# EAGLE schematic washberry (EAGLE 6.4)

## Sheet 1 of 3
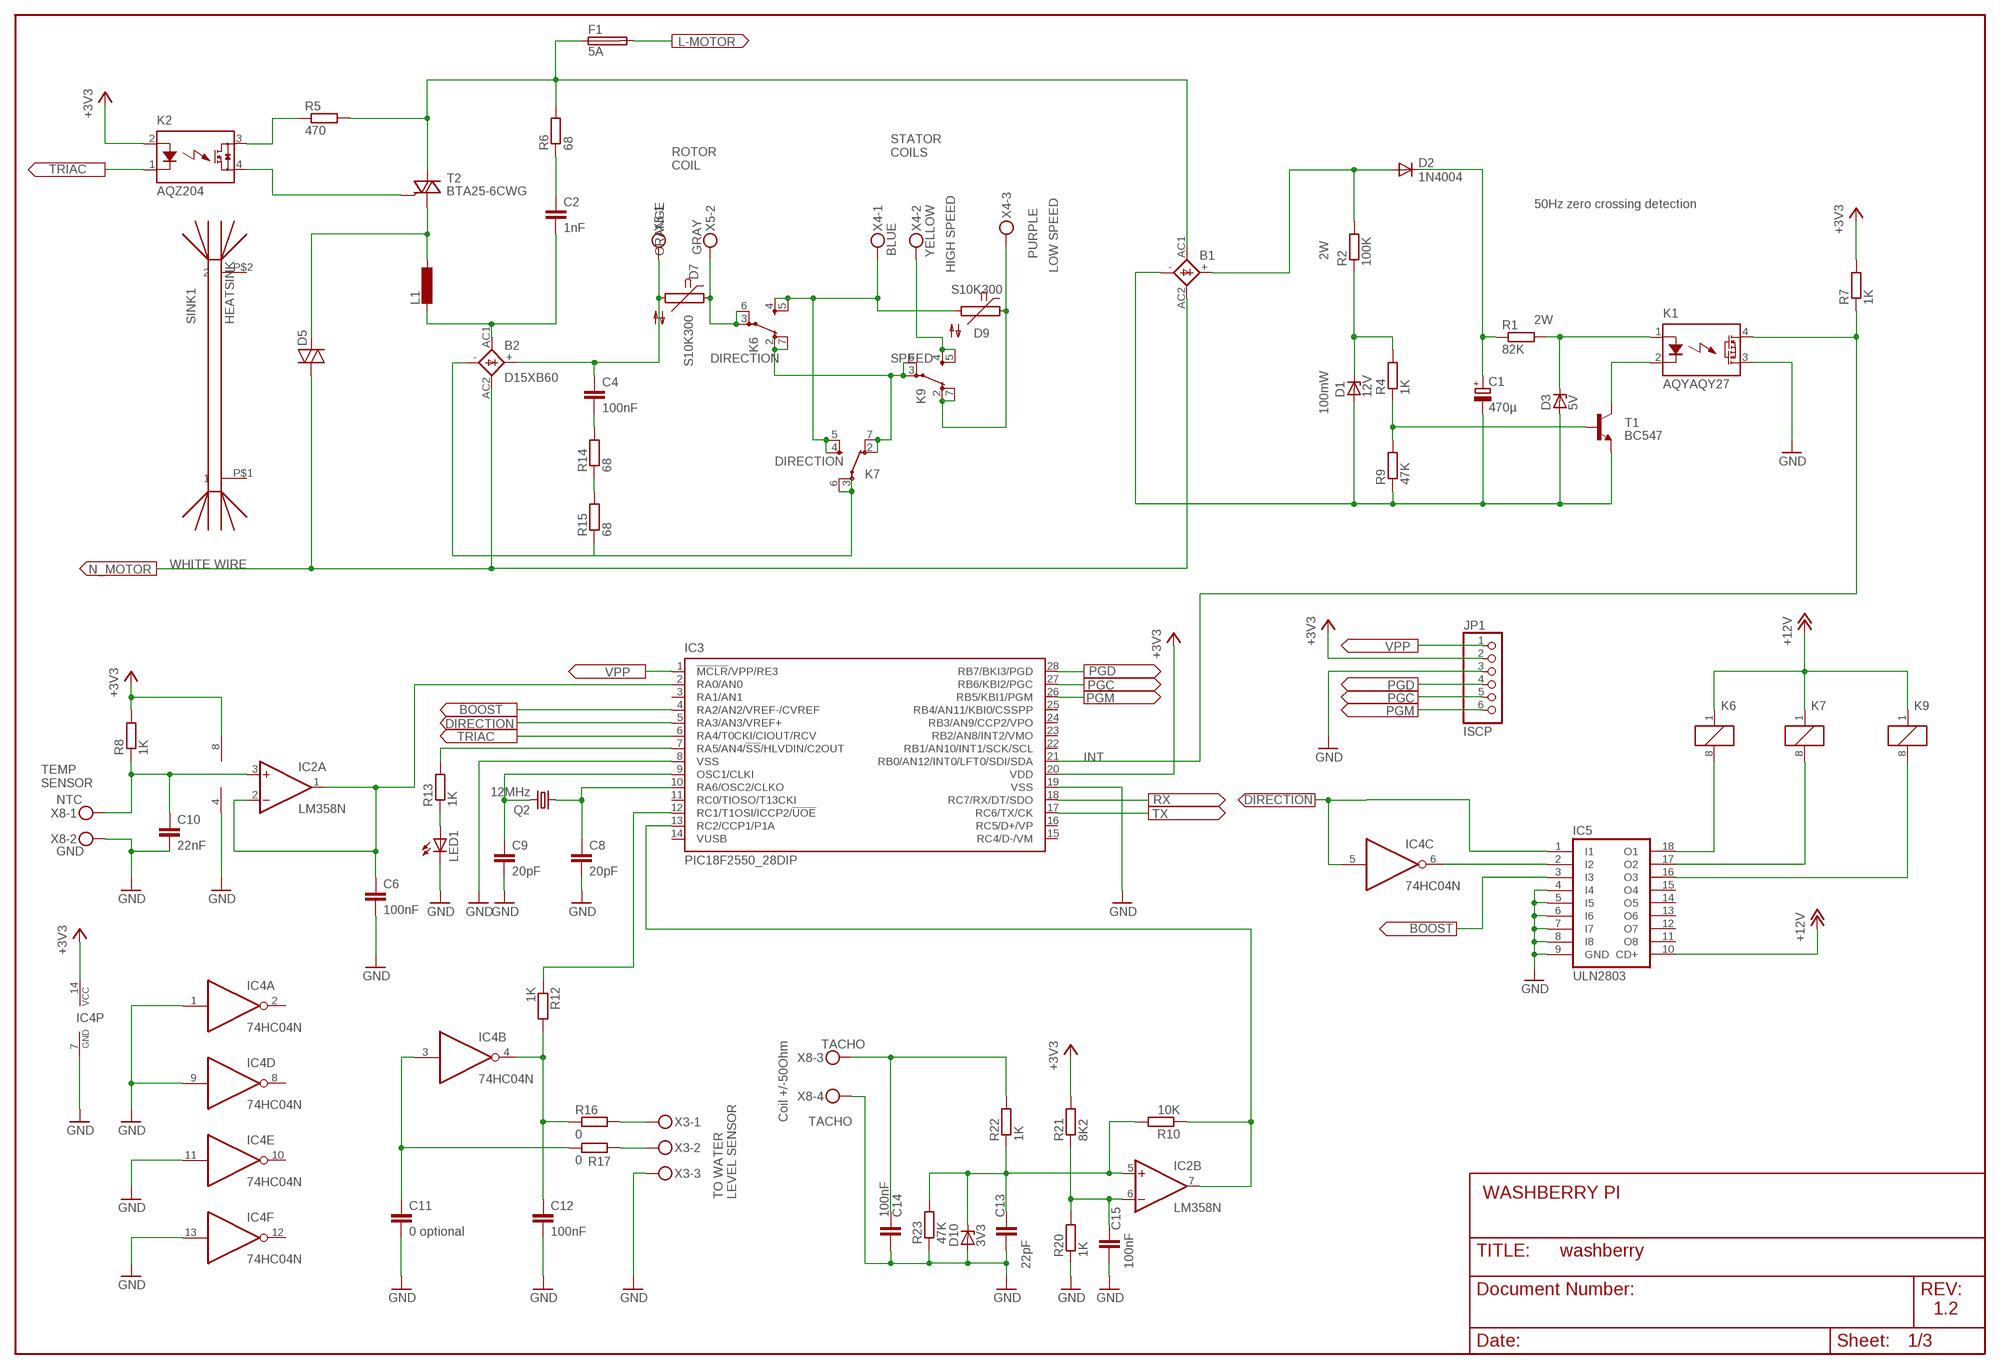
[diagram p0: schematic, sheet 1]

### Parts
B1  2KBB  [2KBB]
B2  D15XB60  [5S]
C1  470µ  CPOL-EUE5-13  [E5-13]
C2  1nF  C-EU150-054X183  [C150-054X183]
C4  100nF  C-EU150-054X183  [C150-054X183]
C6  100nF  C-EU025-024X044  [C025-024X044]
C8  20pF  C-EU025-024X044  [C025-024X044]
C9  20pF  C-EU025-024X044  [C025-024X044]
C10  22nF  C-EU025-024X044  [C025-024X044]
C11  0 optional  C-EU025-024X044  [C025-024X044]
C12  100nF  C-EU025-024X044  [C025-024X044]
C13  22pF  C-EU025-024X044  [C025-024X044]
C14  100nF  C-EU025-024X044  [C025-024X044]
C15  100nF  C-EU025-024X044  [C025-024X044]
D1  12V  ZENER-DIODEDO34-7  [DO34Z7]
D2  1N4004  [DO41-10]
D3  5V  ZENER-DIODEDO34-7  [DO34Z7]
D5  DIAC-DO35-10  [DO35-10]
D7  S10K300  [S10K300]
D9  S10K300  [S10K300]
D10  3V3  ZENER-DIODEDO34-7  [DO34Z7]
F1  5A  GSH15  [GSH15]
IC2  LM358N  [DIL08]
IC3  PIC18F2550_28DIP  [DIL28-3]
IC4  74HC04N  [DIL14]
IC5  ULN2803  ULN2803A  [DIL18]
JP1  ISCP  PINHD-1X6  [1X06]
K1  AQYAQY27  [AQY27]
K2  AQZ204  [AQZ-SIL04]
K6  FTR-K1C  [FTR-K1C]
K7  FTR-K1C  [FTR-K1C]
K9  FTR-K1C  [FTR-K1C]
L1  L-EUTJ5-U1  [TJ5-U1]
LED1  LEDCHIPLED_0805  [CHIPLED_0805]
Q2  12MHz  CRYSTALHC49S  [HC49/S]
R1  82K  R-EU_0617/17  [0617/17]
R2  100K  R-EU_0617/17  [0617/17]
R4  1K  R-EU_0411/3V  [0411V]
R5  470  R-EU_0613/15  [P0613/15]
R6  68  R-EU_0613/15  [P0613/15]
R7  1K  R-EU_0411/3V  [0411V]
R8  1K  R-EU_0411/3V  [0411V]
R9  47K  R-EU_0411/3V  [0411V]
R10  10K  R-EU_0411/3V  [0411V]
R12  1K  R-EU_0411/3V  [0411V]
R13  1K  R-EU_R0805  [R0805]
R14  68  R-EU_0617/17  [0617/17]
R15  68  R-EU_0617/17  [0617/17]
R16  0  R-EU_0411/3V  [0411V]
R17  0  R-EU_0411/3V  [0411V]
R20  1K  R-EU_0411/3V  [0411V]
R21  8K2  R-EU_0411/3V  [0411V]
R22  1K  R-EU_0411/3V  [0411V]
R23  47K  R-EU_0411/3V  [0411V]
SINK1  HEATSINK  W_HEATSINK  [W_HEATSINK]
T1  BC547  [TO92]
T2  BTA25-6CWG  BT138-V  [TO220BV]
X3  MKDSN1,5/3-5,08  [MKDSN1,5/3-5,08]
X4  MKDSN1,5/3-5,08  [MKDSN1,5/3-5,08]
X5  MKDSN1,5/2-5,08  [MKDSN1,5/2-5,08]
X8  MKDSN1,5/9-5,08  [MKDSN1,5/9-5,08]

### Nets
+3V3 [3V3]: IC2.8(P:V+) IC3.20(VDD) IC4.14(P:VCC) JP1.2 K2.2(A) R7.2 R8.2 R21.2 ; also sheet 2,3
+12V [12V]: IC5.10(CD+) K6.1 K7.1 K9.1 ; also sheet 2,3
BOOST [small_signal]: IC3.4(RA2/AN2/VREF-/CVREF) IC5.3(I3)
DIRECTION [small_signal]: IC3.5(RA3/AN3/VREF+) IC4.5(C:I) IC5.1(I1)
GND [GND]: C6.2 C8.2 C9.2 C10.2 C11.2 C12.2 C13.2 C14.2 C15.2 D10.A IC2.4(P:V-) IC3.8(VSS) IC3.19(VSS) IC4.1(A:I) IC4.7(P:GND) IC4.9(D:I) IC4.11(E:I) IC4.13(F:I) IC5.4(I4) IC5.5(I5) IC5.6(I6) IC5.7(I7) IC5.8(I8) IC5.9(GND) JP1.3 K1.3(DS2) LED1.C R20.1 R23.1 X3.3 X8.2 X8.4 ; also sheet 2,3
INT [TRIAC]: IC3.21(RB0/AN12/INT0/LFT0/SDI/SDA) K1.4(DS1) R7.1
L-MOTOR [5A]: F1.2 ; also sheet 2
N$1 [0.25]: K1.2(K) T1.3(C)
N$2 [0.25]: B1.- C1.- D1.A D3.A R9.1 T1.1(E)
N$3 [0.25]: C1.+ D2.C R1.1
N$4 [0.25]: D3.C K1.1(A) R1.2
N$5 [small_signal]: IC3.7(RA5/AN4/!SS!/HLVDIN/C2OUT) R13.2
N$6 [small_signal]: LED1.A R13.1
N$7 [0.25]: D1.C R2.1 R4.2
N$9 [0.25]: R4.1 R9.2 T1.2(B)
N$10 [0.25]: B1.+ D2.A R2.2
N$12 [0.5]: K2.4(DS2) T2.G
N$13 [0.5]: K2.3(DS1) R5.1
N$14: IC2.7(B:OUT) IC3.13(RC2/CCP1/P1A) R10.1
N$16 [5A]: B2.- K7.3(-1:PA) K7.6(-1:PB) R15.1
N$17 [5A]: C2.1 R6.1
N$18 [5A]: B2.AC1 C2.2 L1.2
N$19: C6.1 IC2.1(A:OUT) IC2.2(A:-IN) IC3.2(RA0/AN0)
N$20 [5A]: K9.4(-1:SA) K9.5(-1:SB) X4.2
N$21 [5A]: D9.1 K9.2(-1:OA) K9.7(-1:OB) X4.3
N$23 [5A]: D5.C L1.1 T2.T1(A1)
N$24 [5A]: B2.+ C4.1 D7.2 X5.1
N$25 [small_signal]: C9.1 IC3.9(OSC1/CLKI) Q2.2
N$26 [small_signal]: C8.1 IC3.10(RA6/OSC2/CLKO) Q2.1
N$27 [small_signal]: IC3.12(RC1/T1OSI/ICCP2/!UOE) R12.1
N$28: C11.1 IC4.3(B:I) R17.1
N$29: C12.1 IC4.4(B:O) R12.2 R16.1
N$31 [2A]: R14.1 R15.2
N$32 [2A]: C4.2 R14.2
N$33 [5A]: K6.2(-1:OA) K6.7(-1:OB) K7.2(-1:OA) K7.7(-1:OB) K9.3(-1:PA) K9.6(-1:PB)
N$34 [5A]: D9.2 K6.4(-1:SA) K6.5(-1:SB) K7.4(-1:SA) K7.5(-1:SB) X4.1
N$35 [5A]: D7.1 K6.3(-1:PA) K6.6(-1:PB) X5.2
N$36: IC5.18(O1) K6.8
N$37: R16.2 X3.1
N$38: R17.2 X3.2
N$39: C15.1 IC2.6(B:-IN) R20.2 R21.1
N$41: C13.1 D10.C IC2.5(B:+IN) R10.2 R22.1 R23.2
N$57 [small_signal]: IC4.6(C:O) IC5.2(I2)
N$60: IC5.17(O2) K7.8
N$62: IC5.16(O3) K9.8
N_MOTOR [5A]: B1.AC2 B2.AC2 D5.A ; also sheet 3
NTC: C10.1 IC2.3(A:+IN) R8.1 X8.1
PGC [small_signal]: IC3.27(RB6/KBI2/PGC) JP1.5
PGD [small_signal]: IC3.28(RB7/BKI3/PGD) JP1.4
PGM [small_signal]: IC3.26(RB5/KBI1/PGM) JP1.6
RX: IC3.18(RC7/RX/DT/SDO) ; also sheet 2
SUPPLY_MOTOR [5A]: B1.AC1 F1.1 R5.2 R6.2 T2.T2(A2)
TACHO: C14.1 R22.2 X8.3
TRIAC [TRIAC]: IC3.6(RA4/T0CKI/CIOUT/RCV) K2.1(K)
TX: IC3.17(RC6/TX/CK) ; also sheet 2
VPP [small_signal]: IC3.1(!MCLR!/VPP/RE3) JP1.1
Unconnected: IC3.3(RA1/AN1) IC3.11(RC0/TIOSO/T13CKI) IC3.14(VUSB) IC3.15(RC4/D-/VM) IC3.16(RC5/D+/VP) IC3.22(RB1/AN10/INT1/SCK/SCL) IC3.23(RB2/AN8/INT2/VMO) IC3.24(RB3/AN9/CCP2/VPO) IC3.25(RB4/AN11/KBI0/CSSPP) IC4.2(A:O) IC4.8(D:O) IC4.10(E:O) IC4.12(F:O) IC5.11(O8) IC5.12(O7) IC5.13(O6) IC5.14(O5) IC5.15(O4) SINK1.P$1 SINK1.P$2

### Notes on the sheet
- STATOR
  COILS
- ROTOR
  COIL
- 50Hz zero crossing detection
- ORANGE | GRAY | BLUE | YELLOW
- PURPLE | 2W
- HIGH SPEED | LOW SPEED
- 2W
- DIRECTION | SPEED
- 100mW
- DIRECTION
- WHITE WIRE
- TEMP
  SENSOR
- Coil +/-50Ohm
- TO WATER
  LEVEL SENSOR
- WASHBERRY PI
- 1.2

## Sheet 2 of 3
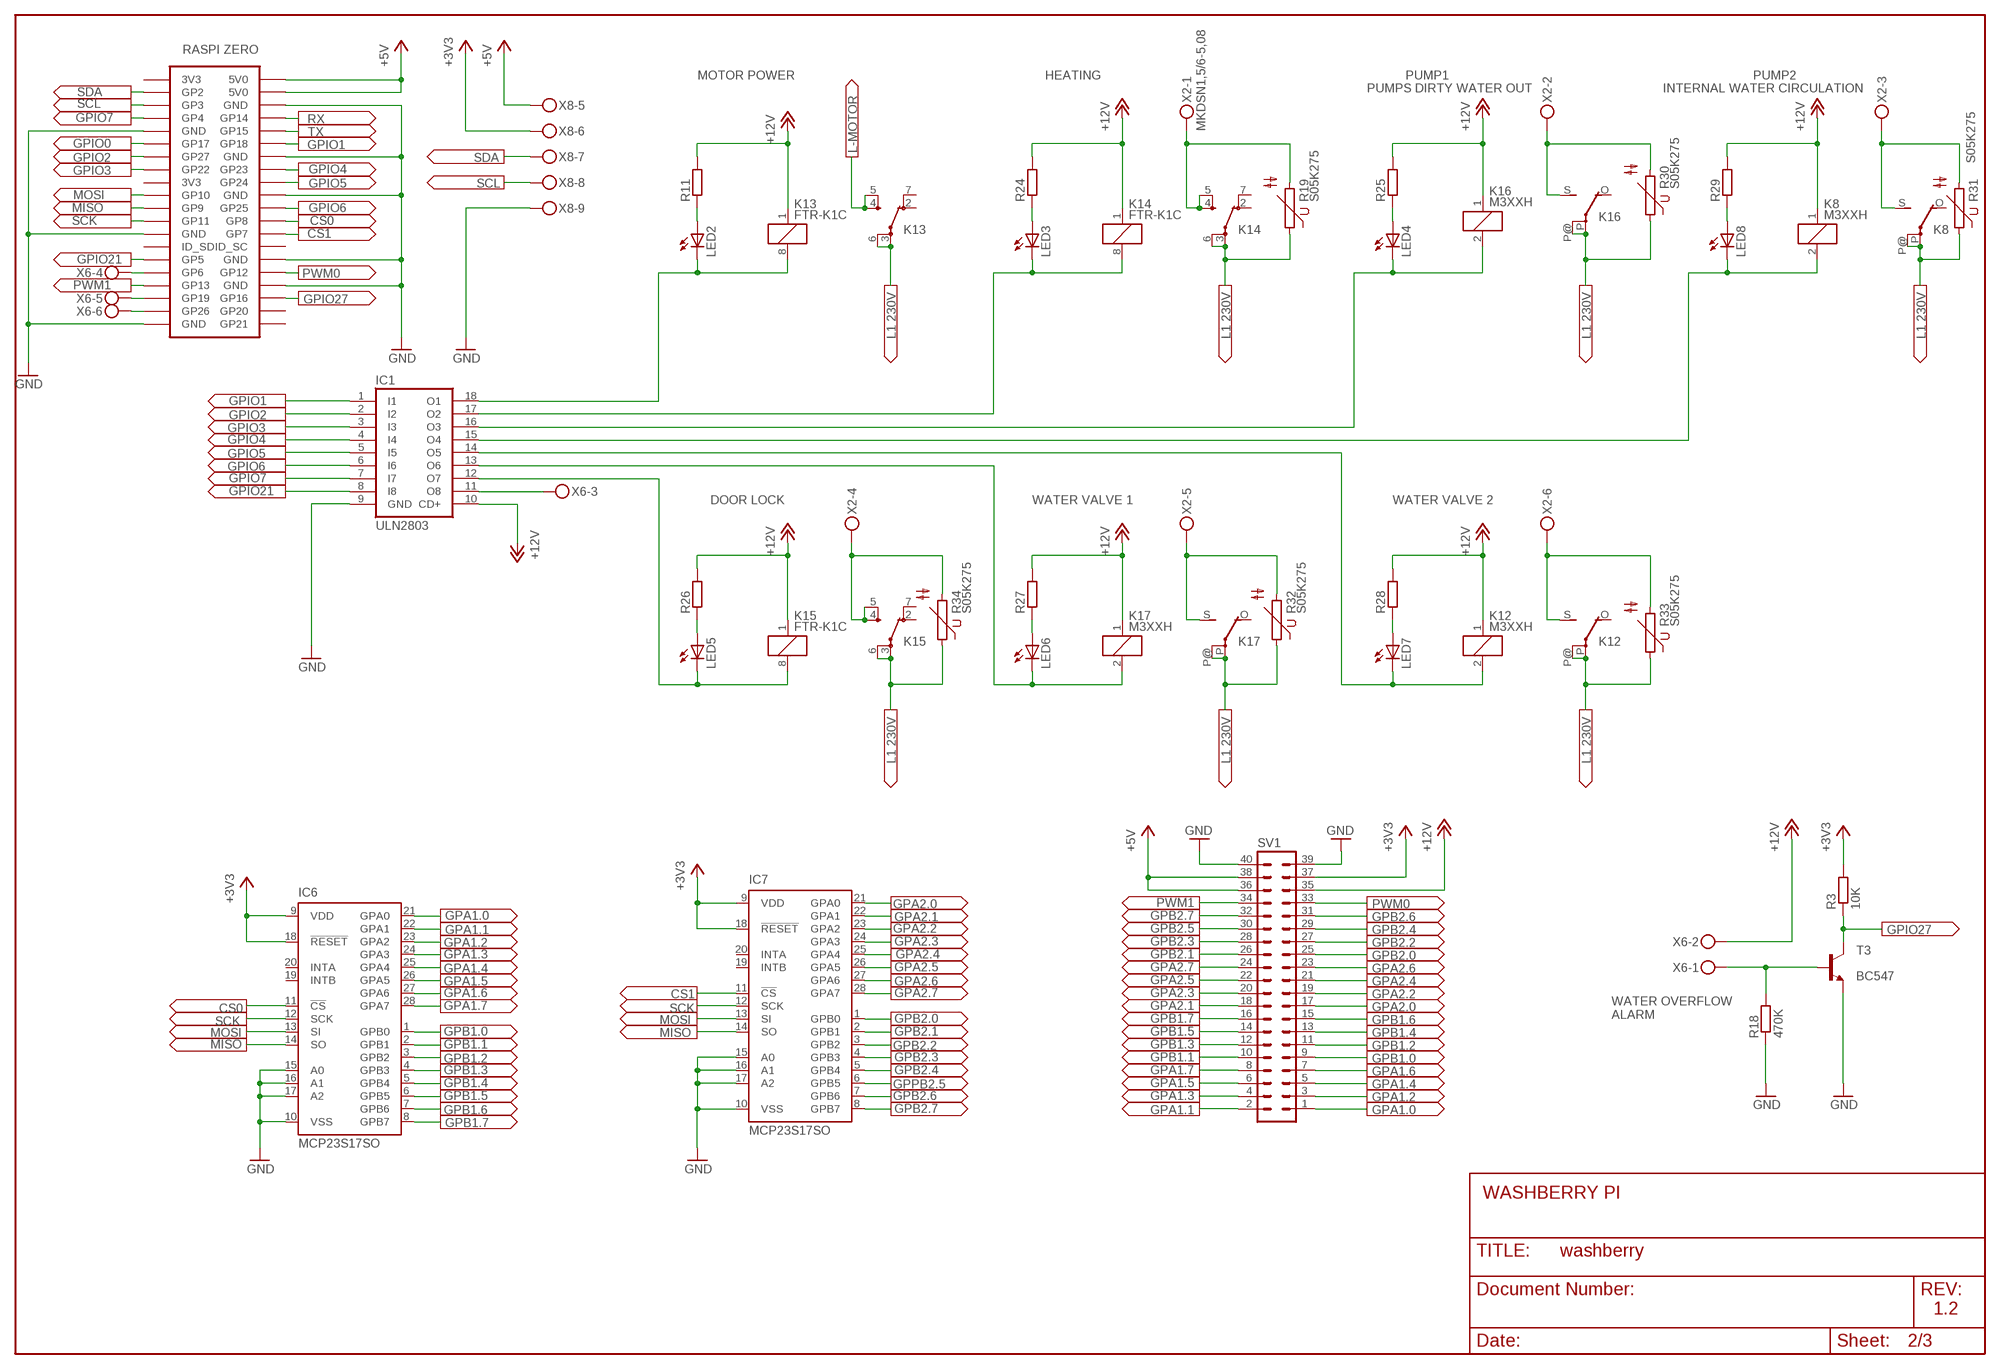
[diagram p1: schematic, sheet 2]

### Parts
IC1  ULN2803  ULN2803A  [DIL18]
IC6  MCP23S17SO  [SO28W]
IC7  MCP23S17SO  [SO28W]
K8  M3XXH  [M3XXH]
K12  M3XXH  [M3XXH]
K13  FTR-K1C  [FTR-K1C]
K14  FTR-K1C  [FTR-K1C]
K15  FTR-K1C  [FTR-K1C]
K16  M3XXH  [M3XXH]
K17  M3XXH  [M3XXH]
LED2  LEDSML0805  [SML0805]
LED3  LEDSML0805  [SML0805]
LED4  LEDSML0805  [SML0805]
LED5  LEDSML0805  [SML0805]
LED6  LEDSML0805  [SML0805]
LED7  LEDSML0805  [SML0805]
LED8  LEDSML0805  [SML0805]
R3  10K  R-EU_0207/2V  [0207/2V]
R11  R-EU_R0805  [R0805]
R18  470K  R-EU_0207/2V  [0207/2V]
R19  S05K275  [S05K275]
R24  R-EU_R0805  [R0805]
R25  R-EU_R0805  [R0805]
R26  R-EU_R0805  [R0805]
R27  R-EU_R0805  [R0805]
R28  R-EU_R0805  [R0805]
R29  R-EU_R0805  [R0805]
R30  S05K275  [S05K275]
R31  S05K275  [S05K275]
R32  S05K275  [S05K275]
R33  S05K275  [S05K275]
R34  S05K275  [S05K275]
SV1  ML40  [ML40]
T3  BC547  [TO92]
U$3  ZERO  [ZERO_NO_DIMENSION]
X2  MKDSN1,5/6-5,08  [MKDSN1,5/6-5,08]
X6  MKDSN1,5/6-5,08  [MKDSN1,5/6-5,08]

### Nets
+3V3 [3V3]: IC6.9(VDD) IC6.18(!RESET) IC7.9(VDD) IC7.18(!RESET) R3.2 SV1.37 X8.6 ; also sheet 1,3
+5V [5V]: SV1.36 SV1.38 U$3.2(5V0) U$3.4(5V0) X8.5 ; also sheet 3
+12V [12V]: IC1.10(CD+) K8.1 K12.1 K13.1 K14.1 K15.1 K16.1 K17.1 R11.2 R24.2 R25.2 R26.2 R27.2 R28.2 R29.2 SV1.35 X6.2 ; also sheet 1,3
CS0: IC6.11(!CS) U$3.24(GP8)
CS1: IC7.11(!CS) U$3.26(GP7)
GND [GND]: IC1.9(GND) IC6.10(VSS) IC6.15(A0) IC6.16(A1) IC6.17(A2) IC7.10(VSS) IC7.15(A0) IC7.16(A1) IC7.17(A2) R18.1 SV1.39 SV1.40 T3.1(E) U$3.6(GND) U$3.9(GND) U$3.14(GND) U$3.20(GND) U$3.25(GND) U$3.30(GND) U$3.34(GND) U$3.39(GND) X8.9 ; also sheet 1,3
GPA1.0: IC6.21(GPA0) SV1.1
GPA1.1: IC6.22(GPA1) SV1.2
GPA1.2: IC6.23(GPA2) SV1.3
GPA1.3: IC6.24(GPA3) SV1.4
GPA1.4: IC6.25(GPA4) SV1.5
GPA1.5: IC6.26(GPA5) SV1.6
GPA1.6: IC6.27(GPA6) SV1.7
GPA1.7: IC6.28(GPA7) SV1.8
GPA2.0: IC7.21(GPA0) SV1.17
GPA2.1: IC7.22(GPA1) SV1.18
GPA2.2: IC7.23(GPA2) SV1.19
GPA2.3: IC7.24(GPA3) SV1.20
GPA2.4: IC7.25(GPA4) SV1.21
GPA2.5: IC7.26(GPA5) SV1.22
GPA2.6: IC7.27(GPA6) SV1.23
GPA2.7: IC7.28(GPA7) SV1.24
GPB1.0: IC6.1(GPB0) SV1.9
GPB1.1: IC6.2(GPB1) SV1.10
GPB1.2: IC6.3(GPB2) SV1.11
GPB1.3: IC6.4(GPB3) SV1.12
GPB1.4: IC6.5(GPB4) SV1.13
GPB1.5: IC6.6(GPB5) SV1.14
GPB1.6: IC6.7(GPB6) SV1.15
GPB1.7: IC6.8(GPB7) SV1.16
GPB2.0: IC7.1(GPB0) SV1.25
GPB2.1: IC7.2(GPB1) SV1.26
GPB2.2: IC7.3(GPB2) SV1.27
GPB2.3: IC7.4(GPB3) SV1.28
GPB2.4: IC7.5(GPB4) SV1.29
GPB2.5: SV1.30
GPB2.6: IC7.7(GPB6) SV1.31
GPB2.7: IC7.8(GPB7) SV1.32
GPIO0: U$3.11(GP17)
GPIO1 [small_signal]: IC1.1(I1) U$3.12(GP18)
GPIO2 [small_signal]: IC1.2(I2) U$3.13(GP27)
GPIO3 [small_signal]: IC1.3(I3) U$3.15(GP22)
GPIO4 [small_signal]: IC1.4(I4) U$3.16(GP23)
GPIO5 [small_signal]: IC1.5(I5) U$3.18(GP24)
GPIO6 [small_signal]: IC1.6(I6) U$3.22(GP25)
GPIO7 [small_signal]: IC1.7(I7) U$3.7(GP4)
GPIO21 [small_signal]: IC1.8(I8) U$3.29(GP5)
GPIO27 [small_signal]: R3.1 T3.3(C) U$3.36(GP16)
GPPB2.5: IC7.6(GPB5)
L [10A]: K8.P(2:P) K8.P@(2:P) K12.P(2:P) K12.P@(2:P) K13.3(-1:PA) K13.6(-1:PB) K14.3(-1:PA) K14.6(-1:PB) K15.3(-1:PA) K15.6(-1:PB) K16.P(2:P) K16.P@(2:P) K17.P(2:P) K17.P@(2:P) R19.1 R30.1 R31.1 R32.1 R33.1 R34.1 ; also sheet 3
L-MOTOR [5A]: K13.4(-1:SA) K13.5(-1:SB) ; also sheet 1
MISO: IC6.14(SO) IC7.14(SO) U$3.21(GP9)
MOSI: IC6.13(SI) IC7.13(SI) U$3.19(GP10)
N$8: IC1.11(O8) X6.3
N$11 [small_signal]: R18.2 T3.2(B) X6.1
N$15: IC1.18(O1) K13.8 LED2.C
N$22: LED2.A R11.1
N$30: IC1.17(O2) K14.8 LED3.C
N$40: LED3.A R24.1
N$42: IC1.16(O3) K16.2 LED4.C
N$43: U$3.31(GP6) X6.4
N$44: U$3.35(GP19) X6.5
N$45: LED4.A R25.1
N$46: LED5.A R26.1
N$49: IC1.13(O6) K17.2 LED6.C
N$50: LED6.A R27.1
N$51: IC1.14(O5) K12.2 LED7.C
N$52: LED7.A R28.1
N$53: IC1.15(O4) K8.2 LED8.C
N$54: LED8.A R29.1
N$55: IC1.12(O7) K15.8 LED5.C
N$58: U$3.37(GP26) X6.6
N$63 [10A]: K14.4(-1:SA) K14.5(-1:SB) R19.2 X2.1
N$64 [0.5]: K16.S(2:S) R30.2 X2.2
N$65 [0.5]: K8.S(2:S) R31.2 X2.3
N$66 [0.5]: K12.S(2:S) R33.2 X2.6
N$67 [0.5]: K17.S(2:S) R32.2 X2.5
N$68 [0.5]: K15.4(-1:SA) K15.5(-1:SB) R34.2 X2.4
PWM0: SV1.33 U$3.32(GP12)
PWM1: SV1.34 U$3.33(GP13)
RX: U$3.8(GP14) ; also sheet 1
SCK: IC6.12(SCK) IC7.12(SCK) U$3.23(GP11)
SCL: U$3.5(GP3) X8.8
SDA: U$3.3(GP2) X8.7
TX: U$3.10(GP15) ; also sheet 1
Unconnected: IC6.19(INTB) IC6.20(INTA) IC7.19(INTB) IC7.20(INTA) K8.O(2:O) K12.O(2:O) K13.2(-1:OA) K13.7(-1:OB) K14.2(-1:OA) K14.7(-1:OB) K15.2(-1:OA) K15.7(-1:OB) K16.O(2:O) K17.O(2:O) U$3.1(3V3) U$3.17(3V3) U$3.27(ID_SD) U$3.28(ID_SC) U$3.38(GP20) U$3.40(GP21)

### Notes on the sheet
- MOTOR POWER | HEATING | PUMP1 | PUMP2
- PUMPS DIRTY WATER OUT | INTERNAL WATER CIRCULATION
- DOOR LOCK | WATER VALVE 1 | WATER VALVE 2
- WATER OVERFLOW
  ALARM
- WASHBERRY PI
- 1.2

## Sheet 3 of 3
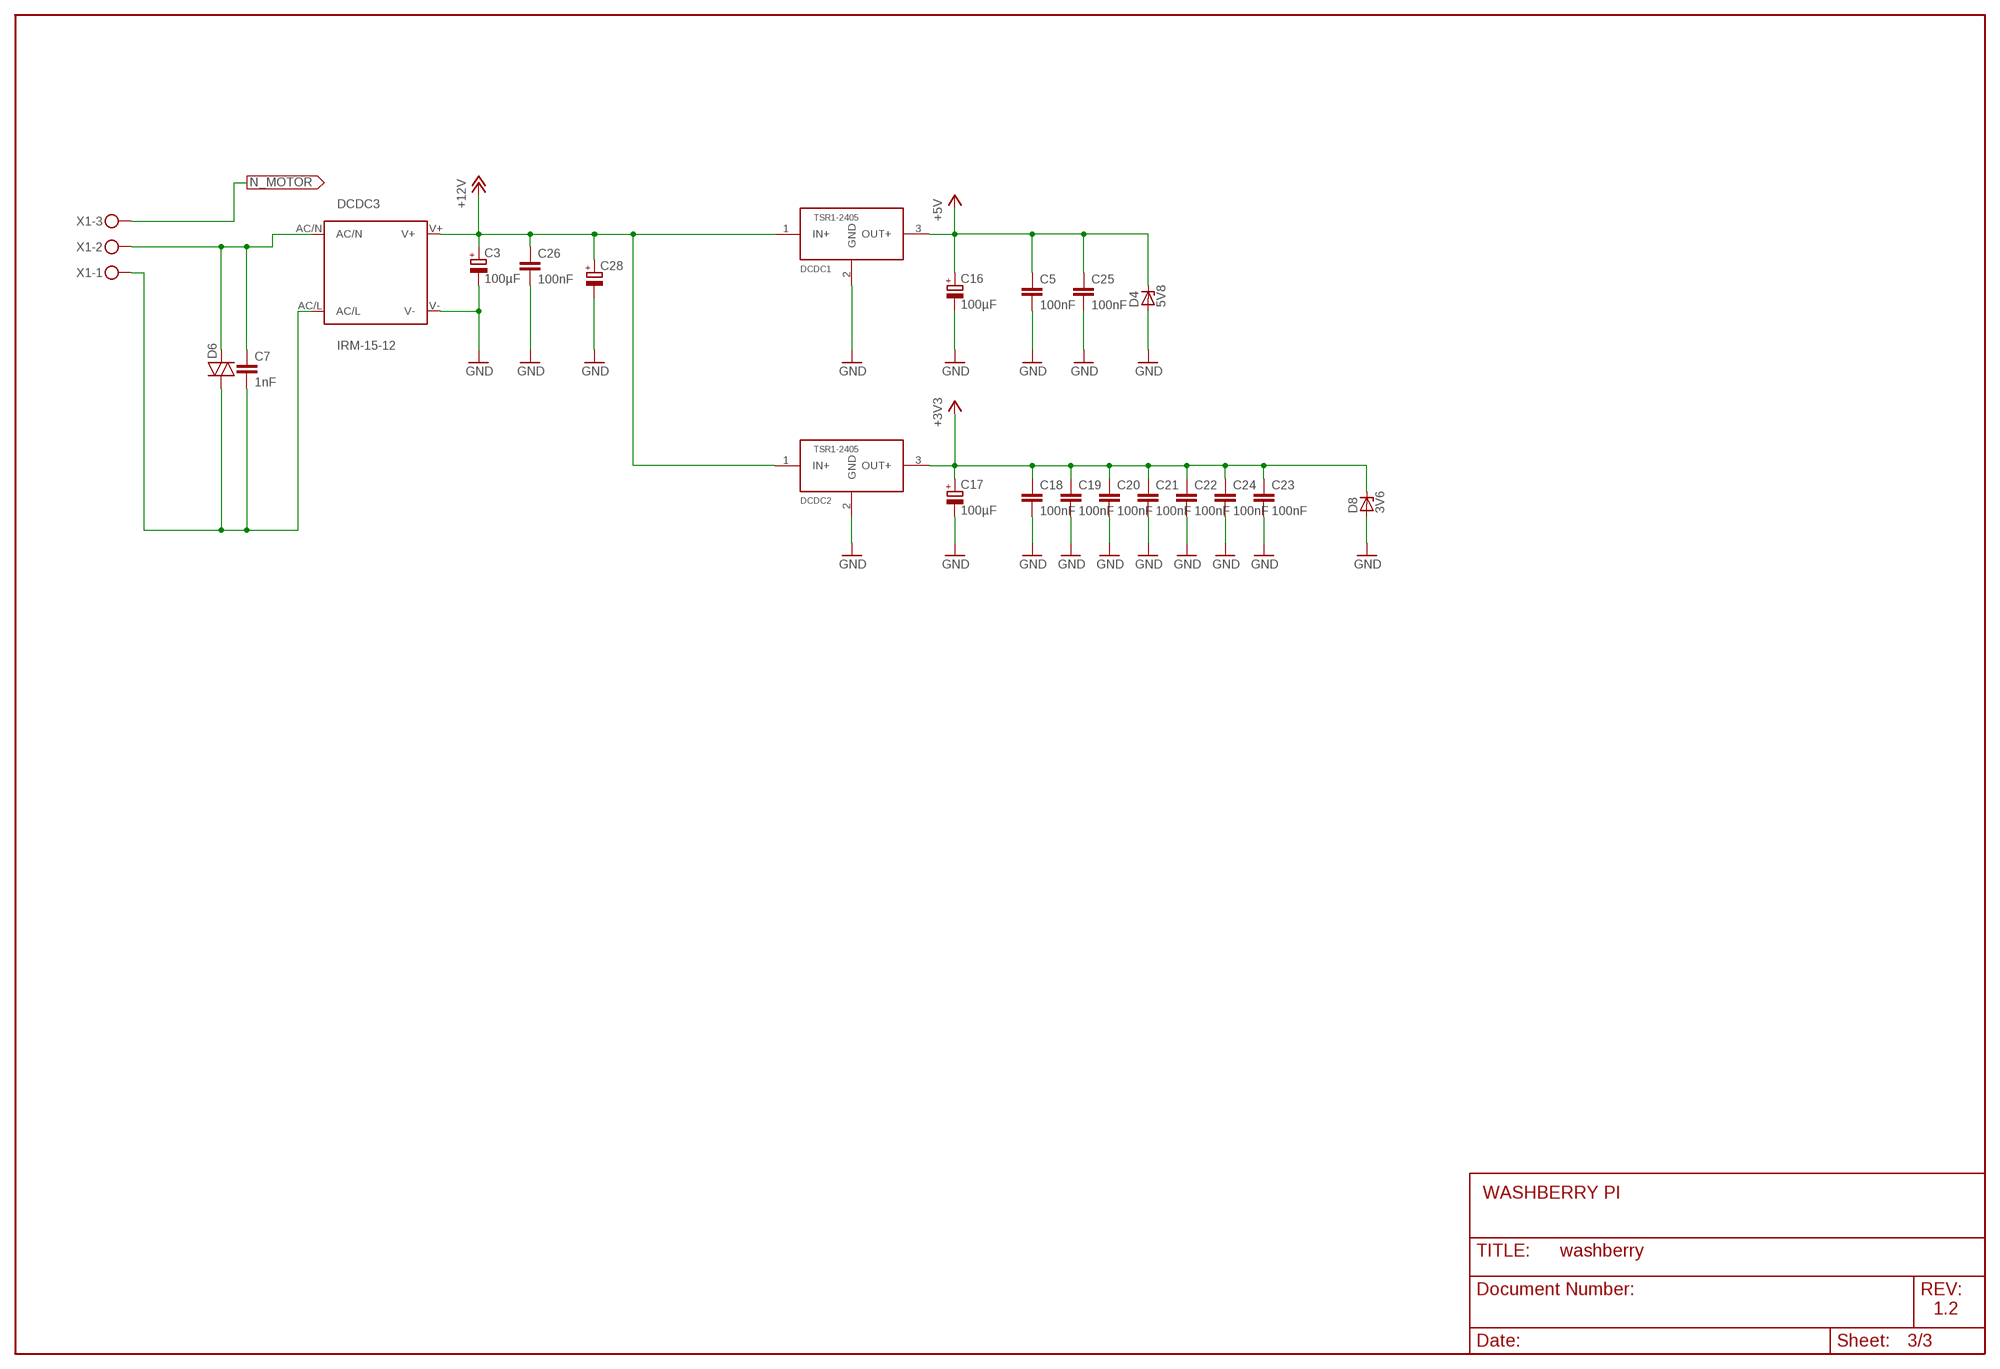
[diagram p2: schematic, sheet 3]

### Parts
C3  100µF  CPOL-EUE3.5-8  [E3,5-8]
C5  100nF  C-EU025-024X044  [C025-024X044]
C7  1nF  C-EU150-091X182  [C150-091X182]
C16  100µF  CPOL-EUE3.5-8  [E3,5-8]
C17  100µF  CPOL-EUE2-5  [E2-5]
C18  100nF  C-EU025-024X044  [C025-024X044]
C19  100nF  C-EU025-024X044  [C025-024X044]
C20  100nF  C-EU025-024X044  [C025-024X044]
C21  100nF  C-EU025-024X044  [C025-024X044]
C22  100nF  C-EU025-024X044  [C025-024X044]
C23  100nF  C-EU025-024X044  [C025-024X044]
C24  100nF  C-EU025-024X044  [C025-024X044]
C25  100nF  C-EU025-024X044  [C025-024X044]
C26  100nF  C-EU025-024X044  [C025-024X044]
C28  CPOL-EUE2-5  [E2-5]
D4  5V8  ZENER-DIODEDO34-7  [DO34Z7]
D6  DIAC-DO35-10  [DO35-10]
D8  3V6  ZENER-DIODEDO34-7  [DO34Z7]
DCDC1  TSR1-2405  TSR1-24XX  [SIPTO220]
DCDC2  TSR1-2405  TSR1-24XX  [SIPTO220]
DCDC3  IRM-15-12  IRM_15/20IRM_15/20  [IRM_15/20]
X1  MKDSN1,5/3-5,08  [MKDSN1,5/3-5,08]

### Nets
+3V3 [3V3]: C17.+ C18.1 C19.1 C20.1 C21.1 C22.1 C23.1 C24.1 D8.C DCDC2.3(OUT+) ; also sheet 1,2
+5V [5V]: C5.1 C16.+ C25.1 D4.C DCDC1.3(OUT+) ; also sheet 2
+12V [12V]: C3.+ C26.1 C28.+ DCDC1.1(IN+) DCDC2.1(IN+) DCDC3.V+ ; also sheet 1,2
GND [GND]: C3.- C5.2 C16.- C17.- C18.2 C19.2 C20.2 C21.2 C22.2 C23.2 C24.2 C25.2 C26.2 C28.- D4.A D8.A DCDC1.2(GND) DCDC2.2(GND) DCDC3.V- ; also sheet 1,2
L [10A]: C7.2 D6.A DCDC3.AC/L X1.1 ; also sheet 2
N [10A]: C7.1 D6.C DCDC3.AC/N X1.2
N_MOTOR [5A]: X1.3 ; also sheet 1

### Notes on the sheet
- WASHBERRY PI
- 1.2

## Library data of the parts
B1 = rectifier:2KBB: RECTIFIER grid 3 x 5 mm
B2 = D15XB60:D15XB60
C1 C3 C16 C17 C28 = rcl:CPOL-EU: POLARIZED CAPACITOR, European symbol
C2 C4-C15 C18-C26 = rcl:C-EU: CAPACITOR, European symbol
D1 D3 D4 D8 D10 = diode:ZENER-DIODE: Z-Diode
D2 = diode:1N4004: DIODE general purpose rectifier, 1 A
D5 D6 = diode:DIAC-: DIAC
D7 D9 = varistor:S10K300: VARISTOR
DCDC1 DCDC2 = TSR1-24XX:TSR1-24XX: TRACO TSR24XX DC/DC converter
DCDC3 = meanwell_irm_v7:IRM_15/20: 15 or 20 watt housing & pin compatible IRM 15 Vout [V] Imax [A] Pmax [W] Eff [%] 3.3 3.5 11.55 74 5 3 15 78 12 1.25 15 82 15 1 15 82 24 0.63 15.12 83 IRM 20 Vout [V] Imax [A] Pmax [W] Eff [%] 3.3 4.5 14.85 76 5 4 20 79 12 1.8 21.6 84 15 1.4 21.6 84 24 0.9 21.6 85
F1 = fuse:GSH15: FUSE HOLDER grid 15mm, 19649 Wickmann; MPN: 64900001039; OC_FARNELL: 1271673; OC_NEWARK: 02P0318
IC1 IC5 = uln-udn:ULN2803A: DRIVER ARRAY
IC2 = linear:LM358: OP AMP also LM158; LM258; LM2904 Source: http://cache.national.com/ds/LM/LM158.pdf
IC3 = microchip:PIC18F2*_28: USB Microcontrollers with nanoWatt Technology High-Performance, Enhanced Flash, 28/40/44-Pin, Source: http://ww1.microchip.com/downloads/en/devicedoc/39632c.pdf; MF: MICROCHIP; MPN: PIC18F2550-I/SP; OC_FARNELL: 1523822; OC_NEWARK: 80K6054
IC4 = 74xx-eu:74*04: Hex INVERTER
IC6 IC7 = microchip:MCP23S17: http://ww1.microchip.com/downloads/en/DeviceDoc/21952a.pdf Source: http://ww1.microchip.com/downloads/en/DeviceDoc/21952a.pdf; MF: MICROCHIP; MPN: MCP23S17-E/SO; OC_FARNELL: unknown; OC_NEWARK: 31K2950
JP1 = pinhead:PINHD-1X6: PIN HEADER
K1 = relay:AQY*: PhotoMOS Relay NAiS Source: http://www.panasonic-electric-works.com/catalogues/downloads/photomos/ds_x615_en_aqz10_20.pdf; OC_FARNELL: unknown; OC_NEWARK: unknown
K2 = relay:AQZ*: Power PhotoMOS Relay NAiS Source: http://www.panasonic-electric-works.com/catalogues/downloads/photomos/ds_x615_en_aqz10_20.pdf; MPN: AQZ204; OC_FARNELL: unknown; OC_NEWARK: 13P1222
K6 K7 K9 K13-K15 = relay:FTR-K1C: NETZRELAIS FTR-K1CK024W1XUM 16A/250VAC 1 Umschaltkontakt Distributor: Conrad Electronic Bestell Nr.: 504389-13 - 24V Source: http://www.produktinfo.conrad.com/datenblaetter/500000-524999/504384-da-01-de-NETZRELAIS_FTR_K1CK012W1XUM_16A_250VAC.pdf; OC_FARNELL: unknown; OC_NEWARK: unknown
K8 K12 K16 K17 = relay:M3XXH: RELAY 1 x switch; OC_FARNELL: unknown; OC_NEWARK: unknown
L1 = rcl:L-EU: INDUCTOR, European symbol
LED1-LED8 = led:LED: LED OSRAM: - CHIPLED LG R971, LG N971, LY N971, LG Q971, LY Q971, LO R971, LY R971 LH N974, LH R974 LS Q976, LO Q976, LY Q976 LO Q996 - Hyper CHIPLED LW Q18S LB Q993, LB Q99A, LB R99A - SideLED LS A670, LO A670, LY A670, LG A670, LP A670 LB A673, LV A673, LT A673, LW A673 LH A674 LY A675 LS A676, LA A676, LO A676, LY A676, LW A676 LS A679, LY A679, LG A679 - Hyper Micro SIDELED® LS Y876, LA Y876, LO Y876, LY Y876 LT Y87S - SmartLED LW L88C, LW L88S LB L89C, LB L89S, LG L890 LS L89K, LO L89K, LY L89K LS L896, LA L896, LO L896, LY L896 - TOPLED LS T670, LO T670, LY T670, LG T670, LP T670 LSG T670, LSP T670, LSY T670, LOP T670, LYG T670 LG T671, LOG T671, LSG T671 LB T673, LV T673, LT T673, LW T673 LH T674 LS T676, LA T676, LO T676, LY T676, LB T676, LH T676, LSB T676, LW T676 LB T67C, LV T67C, LT T67C, LS T67K, LO T67K, LY T67K, LW E67C LS E67B, LA E67B, LO E67B, LY E67B, LB E67C, LV E67C, LT E67C LW T67C LS T679, LY T679, LG T679 LS T770, LO T770, LY T770, LG T770, LP T770 LB T773, LV T773, LT T773, LW T773 LH T774 LS E675, LA E675, LY E675, LS T675 LS T776, LA T776, LO T776, LY T776, LB T776 LHGB T686 LT T68C, LB T68C - Hyper Mini TOPLED® LB M676 - Mini TOPLED Santana® LG M470 LS M47K, LO M47K, LY M47K Source: http://www.osram.convergy.de LUXEON: - LUMILED® LXK2-PW12-R00, LXK2-PW12-S00, LXK2-PW14-U00, LXK2-PW14-V00 LXK2-PM12-R00, LXK2-PM12-S00, LXK2-PM14-U00 LXK2-PE12-Q00, LXK2-PE12-R00, LXK2-PE12-S00, LXK2-PE14-T00, LXK2-PE14-U00 LXK2-PB12-K00, LXK2-PB12-L00, LXK2-PB12-M00, LXK2-PB14-N00, LXK2-PB14-P00, LXK2-PB14-Q00 LXK2-PR12-L00, LXK2-PR12-M00, LXK2-PR14-Q00, LXK2-PR14-R00 LXK2-PD12-Q00, LXK2-PD12-R00, LXK2-PD12-S00 LXK2-PH12-R00, LXK2-PH12-S00 LXK2-PL12-P00, LXK2-PL12-Q00, LXK2-PL12-R00 Source: www.luxeon.com KINGBRIGHT: KA-3528ASYC Source: www.kingbright.com
Q2 = crystal:CRYSTAL: CRYSTAL; OC_FARNELL: 1667008; OC_NEWARK: unknown
R1-R18 R20-R29 = rcl:R-EU_: RESISTOR, European symbol
R19 R30-R34 = varistor:S05K275: VARISTOR
SINK1 = Heatsink_Washmachine:W_HEATSINK
SV1 = con-harting-ml:ML40: HARTING; OC_FARNELL: unknown; OC_NEWARK: unknown
T1 T3 = transistor:BC547: NPN TRANSISTOR
T2 = triac:BT138: TRIAC Source: http://www.semiconductors.philips.com BT138_SERIES_2.pdf
U$3 = RasPiZero:ZERO: Raspbery Pi Foundation Zero https://www.raspberrypi.org/products/pi-zero/
X1 X3 X4 = con-phoenix-508:MKDSN1,5/3-5,08: MKDSN 1,5/ 3-5,08 Printklemme Nennstrom: 13,5 A Nennspannung: 250 V Rastermaß: 5,08 mm Polzahl: 3 Anschlussart: Schraubanschluss Montage: Löten Anschlussrichtung Leiter/Platine: 0 ° Artikelnummer: 1729131 Source: http://eshop.phoenixcontact.com .. 1729131.pdf; MPN: SMKDSN1,5/3-5,08; OC_FARNELL: 1792904; OC_NEWARK: 70R0299
X2 X6 = con-phoenix-508:MKDSN1,5/6-5,08: MKDSN 1,5/ 6-5,08 Printklemme Nennstrom: 13,5 A Nennspannung: 250 V Rastermaß: 5,08 mm Polzahl: 6 Anschlussart: Schraubanschluss Montage: Löten Anschlussrichtung Leiter/Platine: 0 ° Artikelnummer: 1729160 Source: http://eshop.phoenixcontact.com .. 1729160.pdf; MPN: SMKDSN1,5/6-5,08; OC_FARNELL: 1792907; OC_NEWARK: 70R0302
X5 = con-phoenix-508:MKDSN1,5/2-5,08: MKDSN 1,5/ 2-5,08 Printklemme Nennstrom: 13,5 A Nennspannung: 250 V Rastermaß: 5,08 mm Polzahl: 2 Anschlussart: Schraubanschluss Montage: Löten Anschlussrichtung Leiter/Platine: 0 ° Artikelnummer: 1729128 Source: http://eshop.phoenixcontact.com .. 1729128.pdf; MPN: MKDSN 1,5/2-5.08; OC_FARNELL: 1792903; OC_NEWARK: 30M2397
X8 = con-phoenix-508:MKDSN1,5/9-5,08: MKDSN 1,5/ 9-5,08 Printklemme Nennstrom: 13,5 A Nennspannung: 250 V Rastermaß: 5,08 mm Polzahl: 9 Anschlussart: Schraubanschluss Montage: Löten Anschlussrichtung Leiter/Platine: 0 ° Artikelnummer: 1729199 Source: http://eshop.phoenixcontact.com .. 1729199.pdf; MPN: SMKDSN1,5/9-5,08; OC_FARNELL: 1792912; OC_NEWARK: 70R0305

## Net classes
0 default: width 0.254 mm
1 10A: width 3.81 mm, drill 0.001 mm, clearance 1.016 mm
2 5A: width 1.905 mm, drill 0.001 mm, clearance 1.016 mm
3 2A: width 0.635 mm, drill 0.001 mm, clearance 1.016 mm
4 0.5: width 0.508 mm, drill 0.001 mm, clearance 1.016 mm
5 0.25: width 0.254 mm, clearance 1.016 mm
6 12V: width 0.406 mm
7 5V: width 0.406 mm
8 3V3: width 0.406 mm
9 small_signal: width 0.203 mm
10 GND: width 0.406 mm
11 TRIAC: width 0.406 mm